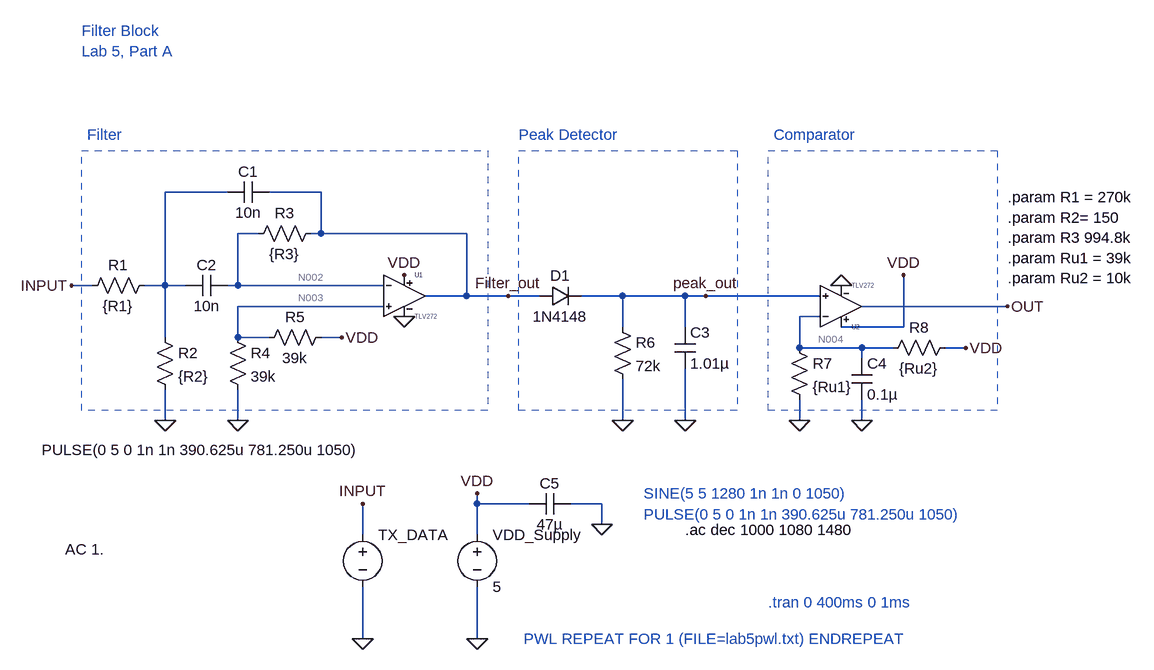
[diagram p0: schematic RxFilter.asc]
RxFilter.asc, the LTspice schematic file:
Version 4
SHEET 1 1352 680
WIRE -144 -48 -240 -48
WIRE 0 -48 -80 -48
WIRE -96 16 -128 16
WIRE 0 16 0 -48
WIRE 0 16 -16 16
WIRE 224 16 0 16
WIRE -352 96 -384 96
WIRE -240 96 -240 -48
WIRE -240 96 -272 96
WIRE -208 96 -240 96
WIRE -128 96 -128 16
WIRE -128 96 -144 96
WIRE 96 96 -128 96
WIRE 224 112 224 16
WIRE 224 112 160 112
WIRE 288 112 224 112
WIRE 336 112 288 112
WIRE 464 112 400 112
WIRE 560 112 464 112
WIRE 592 112 560 112
WIRE 768 112 592 112
WIRE 96 128 -128 128
WIRE 1056 128 832 128
WIRE 768 144 736 144
WIRE 464 160 464 112
WIRE 560 160 560 112
WIRE 896 160 896 80
WIRE 896 160 800 160
WIRE -240 176 -240 96
WIRE -128 176 -128 128
WIRE -80 176 -128 176
WIRE 32 176 0 176
WIRE 736 192 736 144
WIRE 832 192 736 192
WIRE 880 192 832 192
WIRE 992 192 960 192
WIRE 832 208 832 192
WIRE -240 304 -240 256
WIRE -128 304 -128 256
WIRE 464 304 464 240
WIRE 560 304 560 224
WIRE 736 304 736 272
WIRE 832 304 832 272
WIRE 240 432 240 416
WIRE 320 432 240 432
WIRE 432 432 384 432
WIRE 432 464 432 432
WIRE 64 480 64 432
WIRE 240 480 240 432
WIRE 64 640 64 560
WIRE 240 640 240 560
FLAG 240 416 VDD
FLAG 240 640 0
FLAG 128 80 VDD
FLAG 128 144 0
FLAG 64 640 0
FLAG -240 304 0
FLAG -128 304 0
FLAG 32 176 VDD
FLAG 1056 128 OUT
FLAG 64 432 INPUT
FLAG -384 96 INPUT
FLAG 464 304 0
FLAG 560 304 0
FLAG 800 96 0
FLAG 736 304 0
FLAG 896 80 VDD
FLAG 832 304 0
FLAG 992 192 VDD
FLAG 432 464 0
FLAG 288 112 Filter_out
FLAG 592 112 peak_out
SYMBOL voltage 64 464 R0
WINDOW 3 -494 -115 Left 2
WINDOW 123 -458 38 Left 2
WINDOW 39 0 0 Left 2
SYMATTR Value PULSE(0 5 0 1n 1n 390.625u 781.250u 1050)
SYMATTR Value2 AC 1.
SYMATTR InstName TX_DATA
SYMBOL voltage 240 464 R0
SYMATTR InstName VDD_Supply
SYMATTR Value 5
SYMBOL res -256 80 R90
WINDOW 0 0 56 VBottom 2
WINDOW 3 32 56 VTop 2
SYMATTR InstName R1
SYMATTR Value {R1}
SYMBOL cap -80 -64 R90
WINDOW 0 0 32 VBottom 2
WINDOW 3 32 32 VTop 2
SYMATTR InstName C1
SYMATTR Value 10n
SYMBOL cap -144 80 R90
WINDOW 0 0 32 VBottom 2
WINDOW 3 32 32 VTop 2
SYMATTR InstName C2
SYMATTR Value 10n
SYMBOL res 0 0 R90
WINDOW 0 0 56 VBottom 2
WINDOW 3 32 56 VTop 2
SYMATTR InstName R3
SYMATTR Value {R3}
SYMBOL TLV272 128 112 R0
SYMATTR InstName U1
SYMBOL res -256 160 R0
SYMATTR InstName R2
SYMATTR Value {R2}
SYMBOL res -144 160 R0
SYMATTR InstName R4
SYMATTR Value 39k
SYMBOL res 16 160 R90
WINDOW 0 0 56 VBottom 2
WINDOW 3 32 56 VTop 2
SYMATTR InstName R5
SYMATTR Value 39k
SYMBOL diode 336 128 R270
WINDOW 0 32 32 VTop 2
WINDOW 3 0 32 VBottom 2
SYMATTR InstName D1
SYMATTR Value 1N4148
SYMBOL res 448 144 R0
SYMATTR InstName R6
SYMATTR Value 72k
SYMBOL cap 544 160 R0
SYMATTR InstName C3
SYMATTR Value 1.01µ
SYMBOL TLV272 800 128 M180
SYMATTR InstName U2
SYMBOL res 720 176 R0
SYMATTR InstName R7
SYMATTR Value {Ru1}
SYMBOL cap 816 208 R0
SYMATTR InstName C4
SYMATTR Value 0.1µ
SYMBOL res 976 176 R90
WINDOW 0 0 56 VBottom 2
WINDOW 3 32 56 VTop 2
SYMATTR InstName R8
SYMATTR Value {Ru2}
SYMBOL cap 384 416 R90
WINDOW 0 0 32 VBottom 2
WINDOW 3 32 32 VTop 2
SYMATTR InstName C5
SYMATTR Value 47µ
TEXT -360 -136 Left 2 ;Filter
TEXT 304 -136 Left 2 ;Peak Detector
TEXT 696 -136 Left 2 ;Comparator
TEXT -368 -296 Left 2 ;Filter Block\nLab 5, Part A
TEXT 1056 -40 Left 2 !.param R1 = 270k\n.param R2= 150\n.param R3 994.8k\n.param Ru1 = 39k\n.param Ru2 = 10k
TEXT 496 448 Left 2 ;PULSE(0 5 0 1n 1n 390.625u 781.250u 1050)
TEXT 312 640 Left 2 ;PWL REPEAT FOR 1 (FILE=lab5pwl.txt) ENDREPEAT
TEXT 496 416 Left 2 ;SINE(5 5 1280 1n 1n 0 1050)
TEXT 560 472 Left 2 !.ac dec 1000 1080 1480
TEXT 688 584 Left 2 ;.tran 0 400ms 0 1ms
RECTANGLE Normal 256 288 -368 -112 2
RECTANGLE Normal 640 288 304 -112 2
RECTANGLE Normal 1040 288 688 -112 2

The netlist it stands for:
* RxFilter.asc
V§TX_DATA INPUT 0 PULSE(0 5 0 1n 1n 390.625u 781.250u 1050) AC 1.
VDD_Supply VDD 0 5
R1 N001 INPUT {R1}
C1 Filter_out N001 10n
C2 N002 N001 10n
R3 Filter_out N002 {R3}
XU1 N003 N002 VDD 0 Filter_out level.2 Avol=1Meg GBW=3Meg Slew=2.4Meg ilimit=20m rail=0.1 Vos=0 phimargin=45 en=0 enk=0 in=0 ink=0 Rin=500Meg  ; pins In+ In- V+ V- OUT
R2 N001 0 {R2}
R4 N003 0 39k
R5 VDD N003 39k
D1 Filter_out peak_out 1N4148
R6 peak_out 0 72k
C3 peak_out 0 1.01µ
XU2 peak_out N004 VDD 0 OUT level.2 Avol=1Meg GBW=3Meg Slew=2.4Meg ilimit=20m rail=0.1 Vos=0 phimargin=45 en=0 enk=0 in=0 ink=0 Rin=500Meg  ; pins In+ In- V+ V- OUT
R7 N004 0 {Ru1}
C4 N004 0 0.1µ
R8 VDD N004 {Ru2}
C5 0 VDD 47µ
.model D D
.lib standard.dio
* Filter
* Peak Detector
* Comparator
* Filter Block
* Lab 5, Part A
.param R1 = 270k
.param R2= 150
.param R3 994.8k
.param Ru1 = 39k
.param Ru2 = 10k
* PULSE(0 5 0 1n 1n 390.625u 781.250u 1050)
* PWL REPEAT FOR 1 (FILE=lab5pwl.txt) ENDREPEAT
* SINE(5 5 1280 1n 1n 0 1050)
.ac dec 1000 1080 1480
* .tran 0 400ms 0 1ms
.lib UniversalOpamps2.sub
.backanno
.end

* Results of the author's LTspice run, read from the files saved beside the schematic
* Operating Point, zero values left out:
*   V(vdd) = 5 V
*   V(filter_out) = 2.5 V
*   V(n002) = 2.5 V
*   V(n003) = 2.5 V
*   V(peak_out) = 2.076 V
*   V(out) = 100.3 mV
*   V(n004) = 3.98 V
*   I(D1) = 28.84 µA
*   I(R8) = 102 µA
*   I(R7) = 102 µA
*   I(R6) = 28.84 µA
*   I(R5) = 64.1 µA
*   I(R4) = 64.1 µA
*   I(Vdd_supply) = -421.1 µA
*   Ix(u1:3) = 254.4 µA
*   Ix(u1:4) = -225.5 µA
*   Ix(u1:5) = -28.84 µA
*   Ix(u2:1) = -847 pA
*   Ix(u2:2) = 2.959 nA
*   Ix(u2:3) = 576.6 nA
*   Ix(u2:4) = -503.7 nA
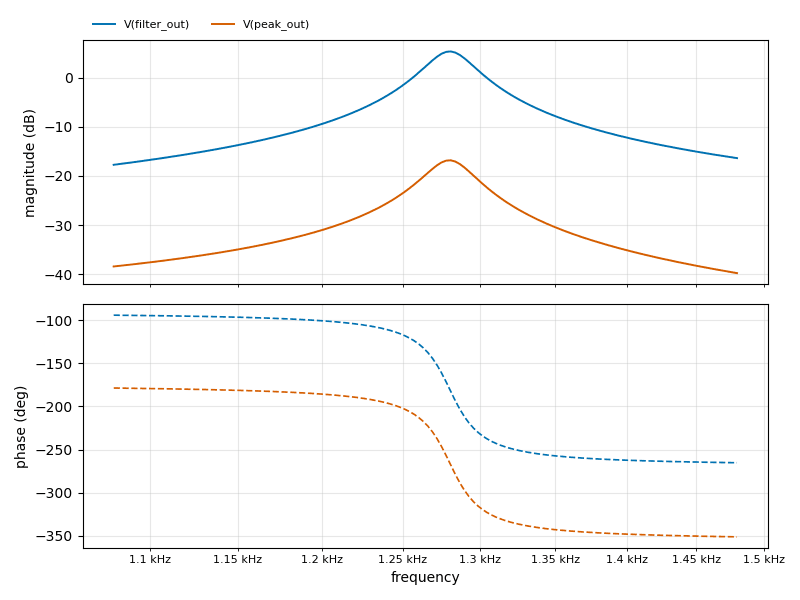
[diagram p1: AC Analysis of RxFilter.asc, plotted from the saved traces]
* AC Analysis, 1 run:
*   V(filter_out): -17.73 dB at 1.08 kHz, -16.37 dB at 1.48 kHz, peak 5.34 dB at 1.281 kHz, 3 dB below the peak at 1.265 kHz and 1.295 kHz
*   V(peak_out): -38.42 dB at 1.08 kHz, -39.77 dB at 1.48 kHz, peak -16.82 dB at 1.281 kHz, 3 dB below the peak at 1.264 kHz and 1.295 kHz